# Altium schematic sheet CAN.SchDoc: Science Sensor: CAN
size Letter; Author: Emela M.; Organization: Husky Robotics; Address1: University of Washington; Address2: Mechanical Engineering; Address3: Seattle, WA; Revision: A; SheetNumber: 3; SheetTotal: 6
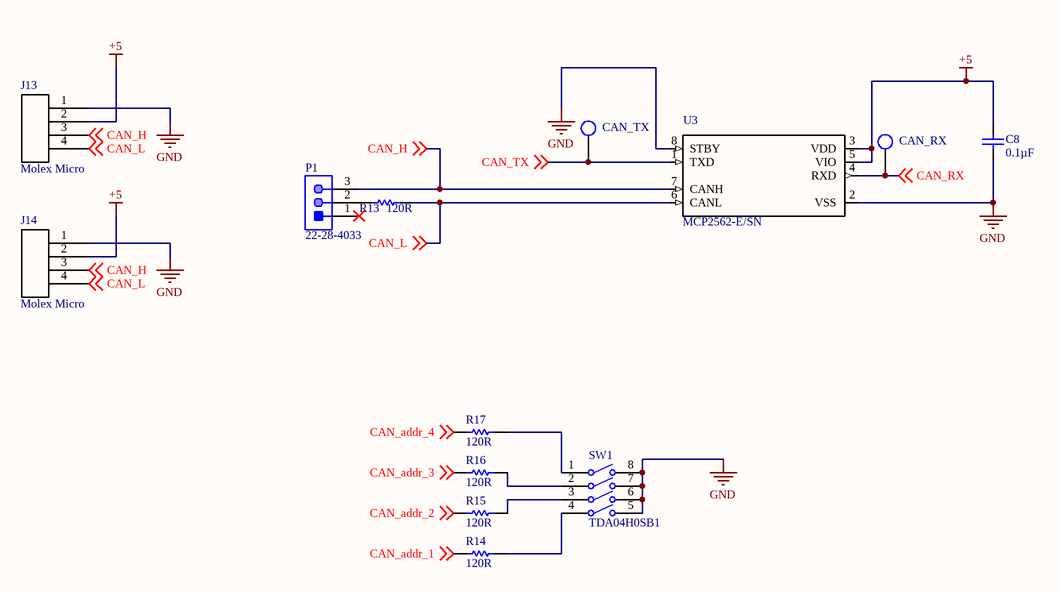
[diagram p0: CAN.SchDoc]

## Parts
C8  Capacitance: 0.1µF  [Cap 0805]  (hidden comment: Capacitor 0805)
CAN_RX  Test Point  [Test Point Through-hole]  (value not drawn)
CAN_TX  Test Point  [Test Point Through-hole]  (value not drawn)
J13  Molex Micro  [MICROFIT R/A 4 PIN]
J14  Molex Micro  [MICROFIT R/A 4 PIN]
P1  22-28-4033  [MOLX-22-28-4033_V]
R13  value 120R  [RESC0805(2012)_N]  (hidden comment: Resistor 0805)
R14  value 120R  [RESC0805(2012)_N]  (hidden comment: Resistor 0805)
R15  value 120R  [RESC0805(2012)_N]  (hidden comment: Resistor 0805)
R16  value 120R  [RESC0805(2012)_N]  (hidden comment: Resistor 0805)
R17  value 120R  [RESC0805(2012)_N]  (hidden comment: Resistor 0805)
SW1  TDA04H0SB1  [CKCP-TDA04H0SB1R_V]
U3  MCP2562-E/SN  [SOIC127P600X175-8N]

## Nets
+5: C8.2 J13.2 J14.2 U3.3(VDD) U3.5(VIO)
GND: C8.1 J13.1 J14.1 SW1.5 SW1.6 SW1.7 SW1.8 U3.2(VSS) U3.8(STBY)
CAN_addr_1: R14.1 ; off-sheet CAN_addr_1
CAN_addr_2: R15.1 ; off-sheet CAN_addr_2
CAN_addr_3: R16.1 ; off-sheet CAN_addr_3
CAN_addr_4: R17.1 ; off-sheet CAN_addr_4
CAN_H: J13.3 J14.3 P1.3 U3.7(CANH) ; off-sheet CAN_H
CAN_L: J13.4 J14.4 R13.2 U3.6(CANL) ; off-sheet CAN_L
CAN_RX: CAN_RX.1 U3.4(RXD) ; off-sheet CAN_RX
CAN_TX: CAN_TX.1 U3.1(TXD) ; off-sheet CAN_TX
NetP1_2: P1.2 R13.1
NetR14_2: R14.2 SW1.4
NetR15_2: R15.2 SW1.3
NetR16_2: R16.2 SW1.2
NetR17_2: R17.2 SW1.1

Not connected (* = marked no-connect by the designer): P1 1*

## Notes on the sheet
- Title
- Size:
- Date:
- A
- Author:
- Revision:
- Sheet
- of
- File:

## Library data of the parts
C8 = Capacitor 0805: Standard Capacitor; Manufacturer: AVX; Tolerance (%): ±10%; Dielectric: X5R; Rated Voltage: 10V; Datasheet Version: 05/2016; Manufacturer URL: http://www.avx.com/; Package Description: 2-Pin Surface Mount Device, Body 2.01 x 1.25 mm; Mounting Technology: SurfaceMount; Case Size/Dimension: 0805; Package Reference: 0805; Datasheet URL: http://datasheets.avx.com/cx5r.pdf
J13 J14 = Molex micro-fit 4-pin (Single row schematic): Molex micro-fit 3.0 dual row header. P/N 0430450427
P1 = CMP-1676-00001-5: Male Header, Pitch 2.54 mm, 1 x 3 Position, Height 8.38 mm, Tail Length 3.18 mm, RoHS, Bulk; Manufacturer: Molex; Rows: 1; Voltage Rating: 250 V; Current Rating: 4 A; Min Operating Temperature: 0 degC; Lead Pitch: 0.1 inch; Packaging: Bulk; Contact Finish: Gold; RoHSCompliant: true; Contact Material: Brass; PackageReference: 22-28-4033; REACH SVHC: Unknown; PackageDescription: Male Header, Pitch 2.54 mm, 1 x 3 Position, Height 8.38 mm, Tail Length 3.18 mm; ComponentLink2URL: http://www.molex.com/pdm_docs/sd/022284033_sd.pdf; Height: 8.38 mm; Mounting Technology: Through Hole; ComponentLink1Description: Manufacturer URL; Length: 7.62 mm; Mount: Through Hole; DatasheetVersion: Rev. G, 01/2012; Max Operating Temperature: 75 degC; ComponentLink2Description: Datasheet; Colour: Black; Pins: 3; Contact Plating: Gold; Package Quantity: 1; ComponentLink1URL: http://www.molex.com/
R13-R17 = Resistor 0805: Generic 0805 Resistor; Tolerance: 5 %; Case-Metric: 2012; Case-EIA: 0805; Power: 0.125 W; Technology: SMT
SW1 = Dip Switch Array SMD Half-Pitch: Ultra-Miniature Surface Mount Half-Pitch DIP Switch, 25 mA, 24 V, -40 to 85 degC, 8-Pin SMD, RoHS, Tube; Contact Current Rating: 100 mA; Throw Configuration: SPST; Voltage Rating (DC): 24 V; Max Contact Resistance: 100 mohm; Max Current Rating: 25 mA; REACH SVHC: No SVHC; DatasheetVersion: 02/2016; Case\Package: DIP; Package Quantity: 70; Lead Pitch: 1.27 mm; Contact Plating: Gold; Packaging: Rail/Tube; Contact Finish: Gold; Mount: Surface Mount; Height: 2.3 mm; Contact Material: Copper; Max Operating Temperature: 85 degC; Max Voltage Rating (DC): 24 V; ComponentLink1URL: https://www.ckswitches.com/media/1328/tda.pdf; PackageDescription: 8-Pin Surface Mount Device, Body 6.21 x 6.2 mm, Pitch 1.27 mm; Radiation Hardening: No; ComponentLink1Description: Datasheet Link; Current Rating: 100 mA; RoHSCompliant: true; PackageReference: TDA04H0SB1R; Min Operating Temperature: -40 degC; Pins: 4; Mounting Technology: Surface Mount; Length: 6.21 mm; Digi-Key_Part_Number: CKN9065-ND; ComponentLink2Description: Digi-Key_Purchase_URL; ComponentLink2URL: https://www.digikey.com/en/products/detail/c-k/TDA04H0SB1/1083755
U3 = CAN Tranceiver: Microchip MCP2562-E/SN, CAN Transceiver 1MBps 1-channel IEC 61000-4-2, 8-Pin SOIC; Price: None; MF: Microchip; SnapEDA_Link: https://www.snapeda.com/parts/MCP2562-E/SN/Microchip/view-part/?ref=snap; MP: MCP2562-E/SN; Availability: Unavailable; Package: SO-8 Microchip; Value: *